# EAGLE design Untitled (EAGLE 7.2.0)
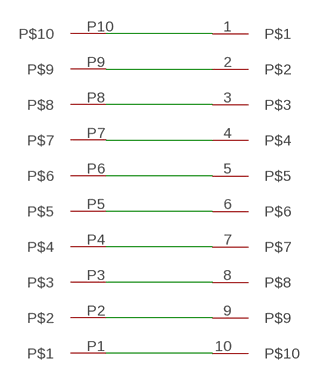
[diagram p0: schematic, sheet 1]

## Parts
U$1  FH12-10S-1SH  [FH12-10S-1SH]
U$2  5-104074-1-CONNECTOR  [5-104074-1-CONNECTOR]

## Nets
N$1: U$1.1 U$2.P10
N$2: U$1.2 U$2.P9
N$3: U$1.3 U$2.P8
N$4: U$1.4 U$2.P7
N$5: U$1.5 U$2.P6
N$6: U$1.6 U$2.P5
N$7: U$1.7 U$2.P4
N$8: U$1.8 U$2.P3
N$9: U$1.9 U$2.P2
N$10: U$1.10 U$2.P1

## Library data of the parts
U$1 = eric-custom:FH12-10S-1SH
U$2 = eric-custom:5-104074-1-CONNECTOR: 10 Positions Header, Shrouded Connector 0.050" (1.27mm) Through Hole, Right Angle Gold

## Board
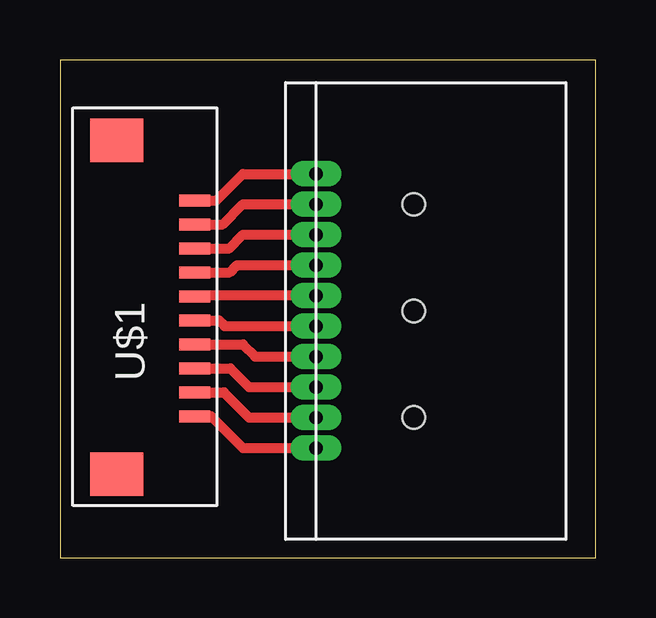
[diagram p1: board, top side]

Size 22.33 x 20.75 mm. Coordinates in mm from the lower left corner, seen from the top.
Outline: 0,0 22.33,0 22.33,20.75 0,20.75 0,0
Copper layers (1*16): Top 0.035mm / dielectric 1.5mm / Bottom 0.035mm
Design rules "default": minimum track width 10mil, minimum drill 24mil, track to track 8mil, track to pad 8mil, pad to pad 8mil, via to via 8mil, smd to smd 8mil, copper to edge 40mil, drill to drill 8mil, minimum pad ring 10mil, minimum via ring 8mil, stop-mask expansion 4mil, vias tented up to drill 0mil, thermal gap 10mil

### Footprints (pad centres in the part's own frame; a part is rotated, then mirrored left to right if it is on the bottom)
FH12-10S-1SH = smd 0.5 x 1.3: 1 4.73,-1.8; 2 3.73,-1.8; 3 2.73,-1.8; 4 1.73,-1.8; 5 0.73,-1.8; 6 -0.27,-1.8; 7 -1.27,-1.8; 8 -2.27,-1.8; 9 -3.27,-1.8; 10 -4.27,-1.8 | smd 1.8 x 2.2: P$1 -6.68,1.45; P$2 7.24,1.45
5-104074-1-CONNECTOR = drill 0.559 pad 0.711 long: P1 -6.35,0; P2 -5.08,0; P3 -3.81,0; P4 -2.54,0; P5 -1.27,0; P6 0,0; P7 1.27,0; P8 2.54,0; P9 3.81,0; P10 5.08,0 | hole 0.94: -5.08,-4.064; 3.81,-4.064; -0.635,-4.064

### Placement (x,y rotation side)
U$1  3.81,10.16 90 top
U$2  10.67,10.92 90 top

### Tracks (layer width: path | path; a pad name or v marks a point on that pad's centre or on a via)
N$1
  Top 0.406: U$1.1 6.51,14.89 7.62,16 U$2.P10
N$2
  Top 0.406: U$1.2 6.78,13.89 7.62,14.73 U$2.P9
N$3
  Top 0.406: U$1.3 7.05,12.89 7.62,13.46 U$2.P8
N$4
  Top 0.406: U$1.4 7.06,11.89 7.37,12.19 U$2.P7
N$5
  Top 0.406: U$2.P6 5.64,10.92 U$1.5
N$6
  Top 0.406: U$1.6 6.62,9.89 6.86,9.65 U$2.P5
N$7
  Top 0.406: U$1.7 7.62,8.89 8.13,8.38 U$2.P4
N$8
  Top 0.406: U$1.8 7.1,7.89 7.87,7.11 U$2.P3
N$9
  Top 0.406: U$1.9 6.83,6.89 7.87,5.84 U$2.P2
N$10
  Top 0.406: U$1.10 6.3,5.89 7.62,4.57 U$2.P1